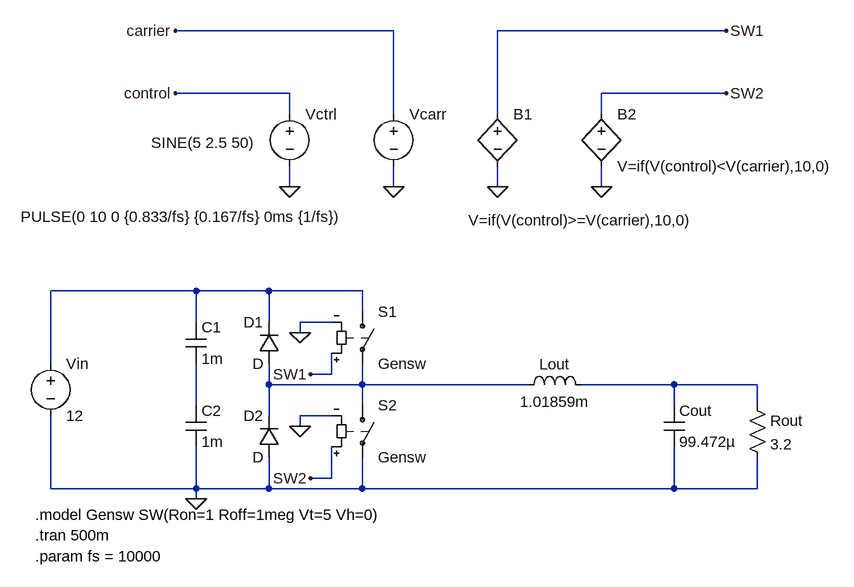
[diagram p0: schematic Capstone Half-Leg Inverter.asc]
Capstone Half-Leg Inverter.asc, the LTspice schematic file:
Version 4
SHEET 1 1216 680
WIRE 464 -384 128 -384
WIRE 976 -384 624 -384
WIRE 304 -288 128 -288
WIRE 976 -288 784 -288
WIRE 304 -256 304 -288
WIRE 464 -256 464 -384
WIRE 624 -256 624 -384
WIRE 784 -256 784 -288
WIRE 304 -144 304 -176
WIRE 464 -144 464 -176
WIRE 624 -144 624 -176
WIRE 784 -144 784 -176
WIRE 160 16 -64 16
WIRE 272 16 160 16
WIRE 416 16 272 16
WIRE 416 48 416 16
WIRE 160 64 160 16
WIRE 272 64 272 16
WIRE 368 64 320 64
WIRE 320 80 320 64
WIRE -64 128 -64 16
WIRE 368 144 368 112
WIRE 368 144 336 144
WIRE 272 160 272 128
WIRE 416 160 416 128
WIRE 416 160 272 160
WIRE 672 160 416 160
WIRE 896 160 752 160
WIRE 1024 160 896 160
WIRE 160 192 160 128
WIRE 416 192 416 160
WIRE 896 192 896 160
WIRE 1024 192 1024 160
WIRE 272 208 272 160
WIRE 368 208 320 208
WIRE 320 224 320 208
WIRE 368 304 368 256
WIRE 368 304 336 304
WIRE -64 320 -64 208
WIRE 160 320 160 256
WIRE 160 320 -64 320
WIRE 272 320 272 272
WIRE 272 320 160 320
WIRE 416 320 416 272
WIRE 416 320 272 320
WIRE 896 320 896 256
WIRE 896 320 416 320
WIRE 1024 320 1024 272
WIRE 1024 320 896 320
WIRE 160 336 160 320
FLAG 160 336 0
FLAG 304 -144 0
FLAG 464 -144 0
FLAG 624 -144 0
FLAG 784 -144 0
FLAG 976 -288 SW2
FLAG 976 -384 SW1
FLAG 128 -288 control
FLAG 128 -384 carrier
FLAG 320 80 0
FLAG 320 224 0
FLAG 336 144 SW1
FLAG 336 304 SW2
SYMBOL voltage -64 112 R0
WINDOW 123 0 0 Left 0
WINDOW 39 0 0 Left 0
SYMATTR InstName Vin
SYMATTR Value 12
SYMBOL cap 144 64 R0
SYMATTR InstName C1
SYMATTR Value 1m
SYMBOL cap 144 192 R0
SYMATTR InstName C2
SYMATTR Value 1m
SYMBOL sw 416 32 R0
SYMATTR InstName S1
SYMATTR Value Gensw
SYMBOL sw 416 176 R0
SYMATTR InstName S2
SYMATTR Value Gensw
SYMBOL ind 656 176 R270
WINDOW 0 32 56 VTop 2
WINDOW 3 5 56 VBottom 2
SYMATTR InstName Lout
SYMATTR Value 1.01859m
SYMBOL cap 880 192 R0
SYMATTR InstName Cout
SYMATTR Value 99.472µ
SYMBOL res 1008 176 R0
SYMATTR InstName Rout
SYMATTR Value 3.2
SYMBOL voltage 304 -272 R0
WINDOW 3 -213 60 Left 2
SYMATTR Value SINE(5 2.5 50)
SYMATTR InstName Vctrl
SYMBOL voltage 464 -272 R0
WINDOW 3 -574 174 Left 2
SYMATTR Value PULSE(0 10 0 {0.833/fs} {0.167/fs} 0ms {1/fs})
SYMATTR InstName Vcarr
SYMBOL bv 624 -272 R0
WINDOW 3 -45 179 Left 2
SYMATTR Value V=if(V(control)>=V(carrier),10,0)
SYMATTR InstName B1
SYMBOL bv 784 -272 R0
SYMATTR InstName B2
SYMATTR Value V=if(V(control)<V(carrier),10,0)
SYMBOL diode 288 128 R180
WINDOW 0 24 64 Left 2
WINDOW 3 24 0 Left 2
SYMATTR InstName D1
SYMBOL diode 288 272 R180
WINDOW 0 24 64 Left 2
WINDOW 3 24 0 Left 2
SYMATTR InstName D2
TEXT -88 360 Left 2 !.model Gensw SW(Ron=1 Roff=1meg Vt=5 Vh=0)
TEXT -88 392 Left 2 !.tran 500m
TEXT -88 424 Left 2 !.param fs = 10000

The netlist it stands for:
* Capstone Half-Leg Inverter.asc
Vin N001 0 12
C1 N001 N004 1m
C2 N004 0 1m
S1 N001 N002 SW1 0 Gensw
S2 N002 0 SW2 0 Gensw
Lout N002 N003 1.01859m
Cout N003 0 99.472µ
Rout N003 0 3.2
Vctrl control 0 SINE(5 2.5 50)
Vcarr carrier 0 PULSE(0 10 0 {0.833/fs} {0.167/fs} 0ms {1/fs})
B1 SW1 0 V=if(V(control)>=V(carrier),10,0)
B2 SW2 0 V=if(V(control)<V(carrier),10,0)
D1 N002 N001 D
D2 0 N002 D
.model D D
.lib standard.dio
.model Gensw SW(Ron=1 Roff=1meg Vt=5 Vh=0)
.tran 500m
.param fs = 10000
.backanno
.end